# Altium project balan.PrjPcb
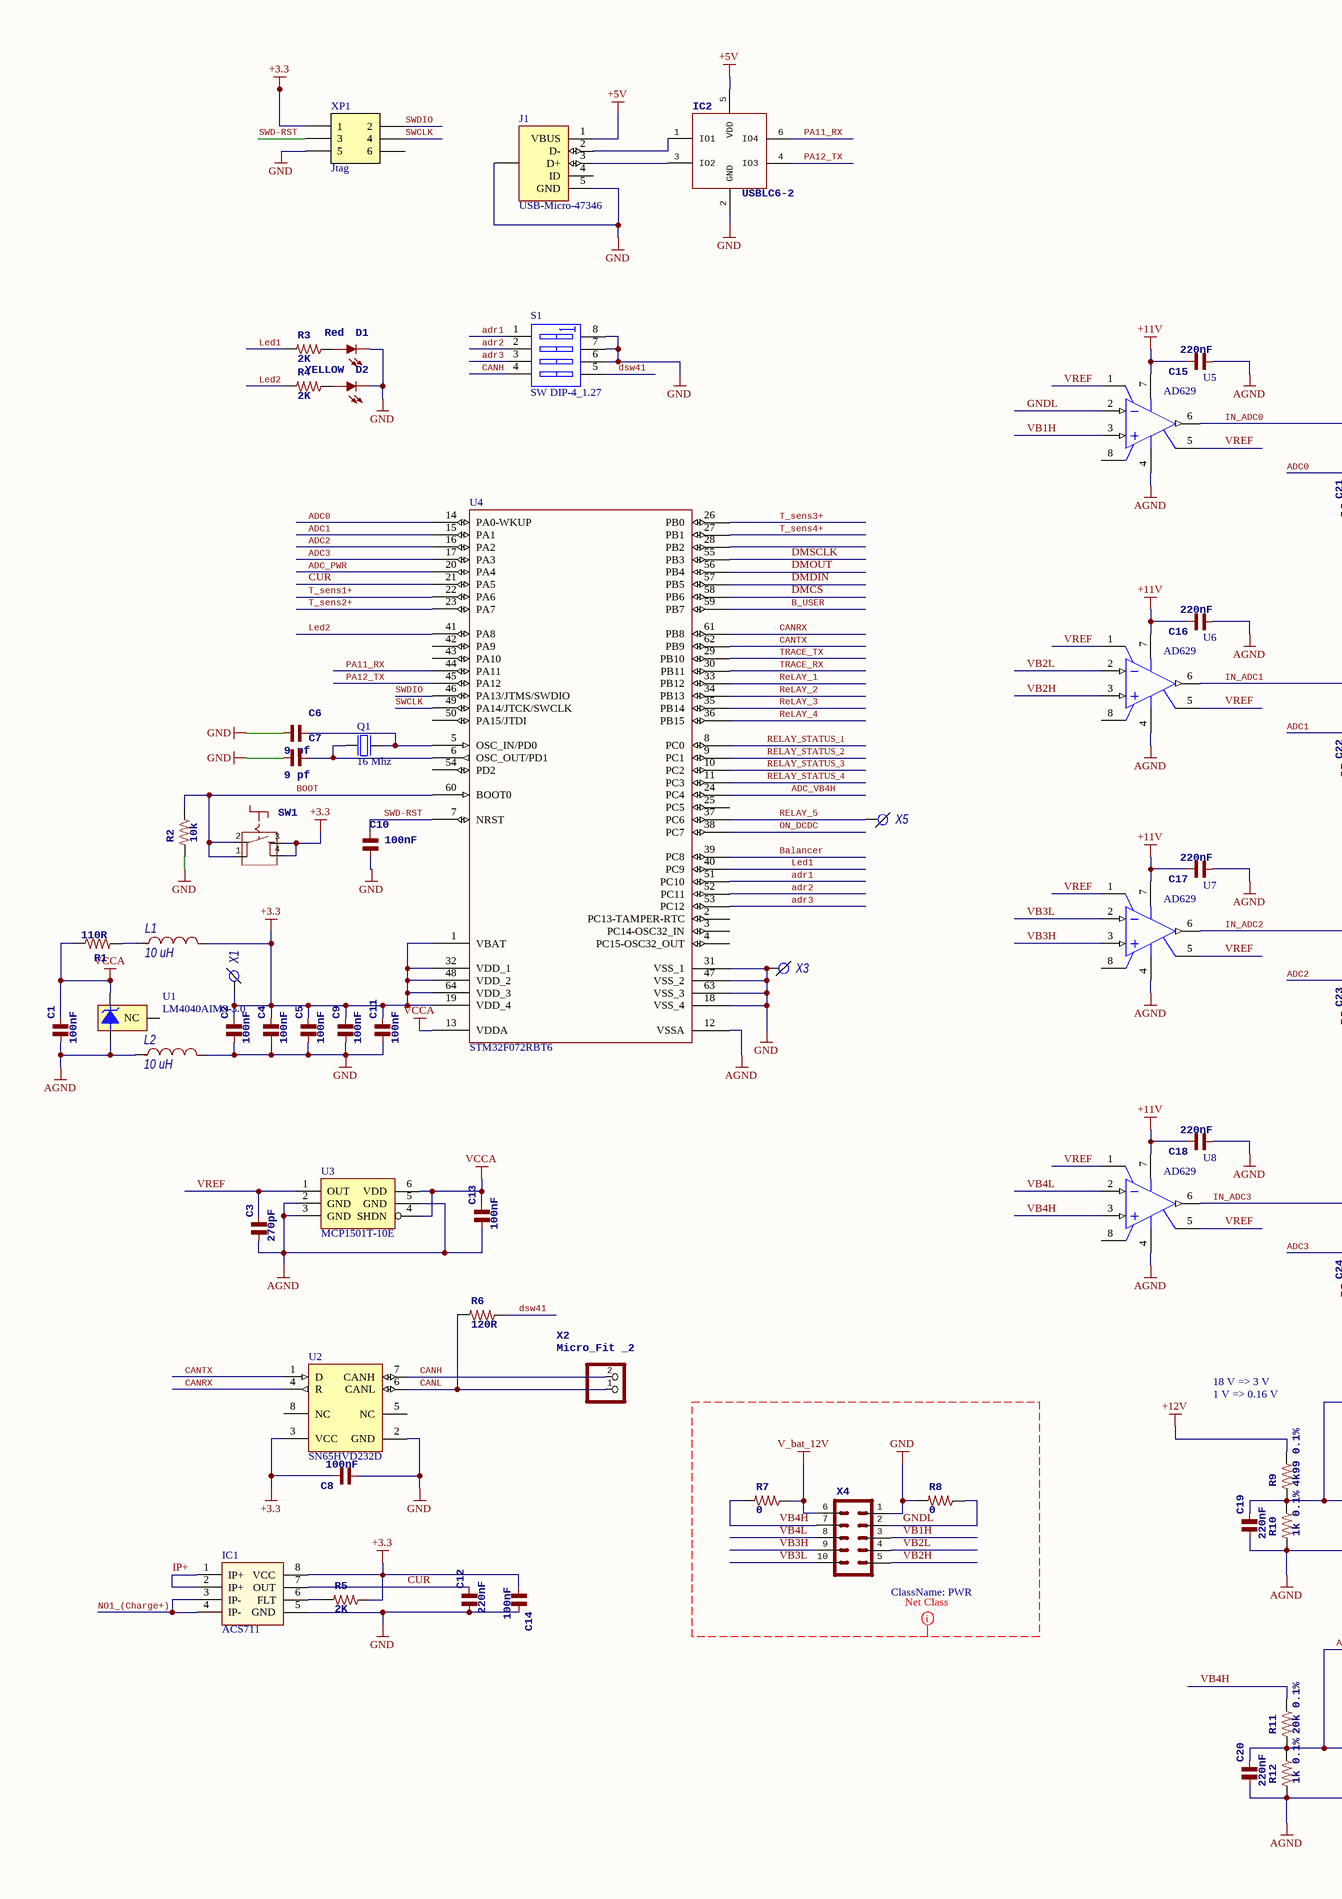
[diagram p0: Rev_C_Mcu.SchDoc, left]
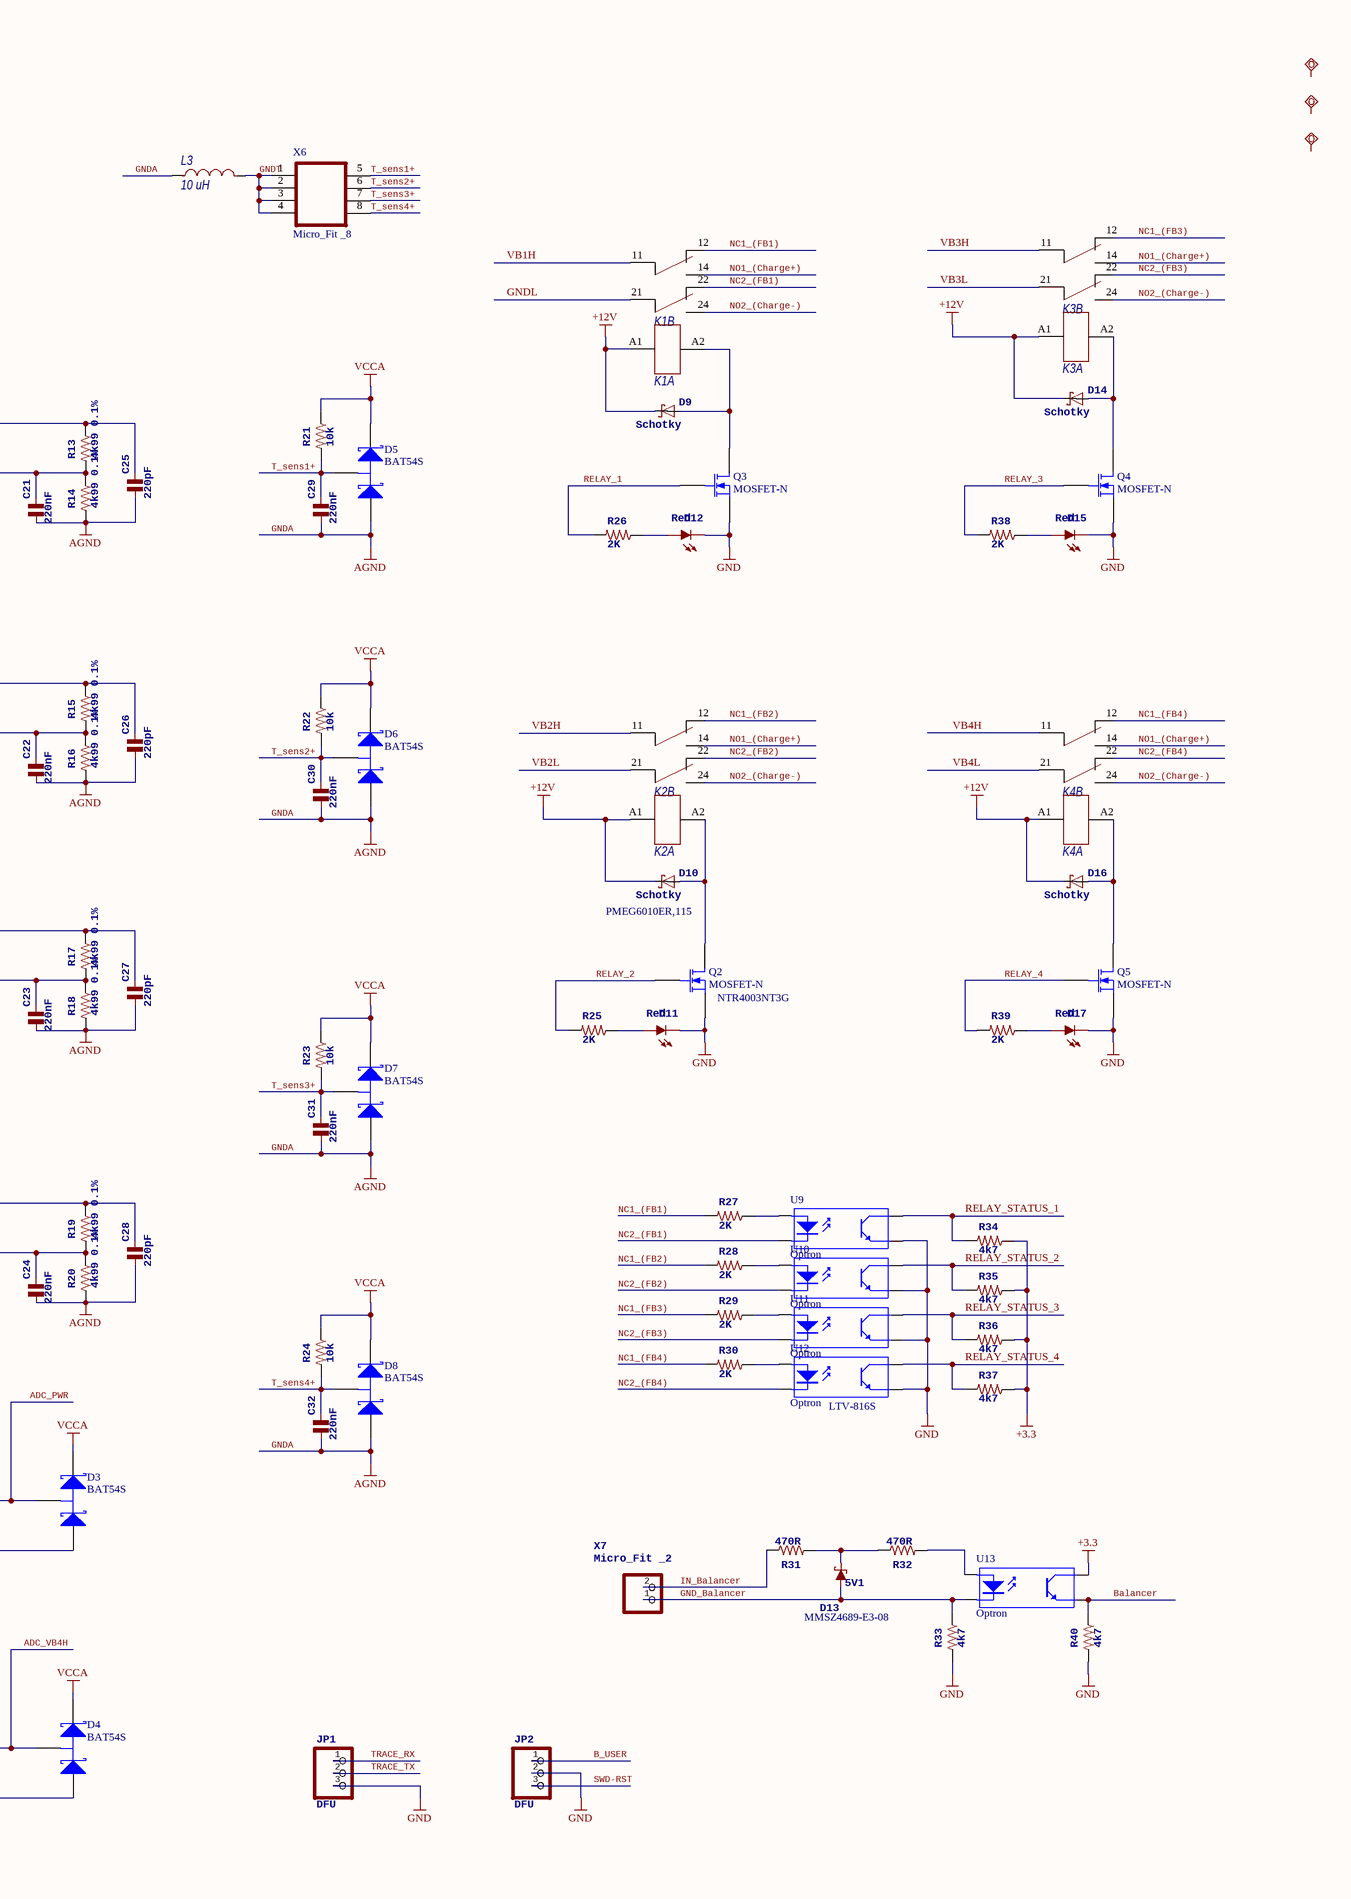
[diagram p1: Rev_C_Mcu.SchDoc, right]
2 sheets, 167 parts. Net scope: global (net labels, ports and power ports of the same name join across sheets).
Board file: balan_31.PcbDoc
Sheets:
  Rev_C_Mcu.SchDoc
  Rev_C_Power.SchDoc

## Sheet Rev_C_Mcu.SchDoc
size A2; Organization: Altium Limited; Address1: L3, 12a Rodborough Rd; Address2: Frenchs Forest; Address3: NSW; Address4: Australia 2086

### Parts
C1  100nF  [C0603]
C2  100nF  [C0603]
C3  270pF  [C0603]
C4  100nF  [C0603]
C5  100nF  [C0603]
C6  9 pf  [C0603]
C7  9 pf  [C0603]
C8  100nF  [C0603]
C9  100nF  [C0603]
C10  100nF  [C0603]
C11  100nF  [C0603]
C12  220nF  [C0603]
C13  100nF  [C0603]
C14  100nF  [C0603]
C15  220nF  [C0603]
C16  220nF  [C0603]
C17  220nF  [C0603]
C18  220nF  [C0603]
C19  220nF  [C0603]
C20  220nF  [C0603]
C21  220nF  [C0603]
C22  220nF  [C0603]
C23  220nF  [C0603]
C24  220nF  [C0603]
C25  220pF  [C0603]
C26  220pF  [C0603]
C27  220pF  [C0603]
C28  220pF  [C0603]
C29  220nF  [C0603]
C30  220nF  [C0603]
C31  220nF  [C0603]
C32  220nF  [C0603]
D1  Red  [CHIP-LED0603]
D2  YELLOW  [CHIP-LED0603]
D3  BAT54S  [SOT23_N]
D4  BAT54S  [SOT23_N]
D5  BAT54S  [SOT23_N]
D6  BAT54S  [SOT23_N]
D7  BAT54S  [SOT23_N]
D8  BAT54S  [SOT23_N]
D9  Schotky  [SOD123F]
D10  Schotky  Des: PMEG6010ER,115  [SOD123F]
D11  Red  [CHIP-LED0603]
D12  Red  [CHIP-LED0603]
D13  5V1  [425]
D14  Schotky  [SOD123F]
D15  Red  [CHIP-LED0603]
D16  Schotky  [SOD123F]
D17  Red  [CHIP-LED0603]
IC1  ACS711  [SO8-ACS]
IC2  USBLC6-2  [SOT23-6L]
J1  USB-Micro-47346  [USB_micro_B]
JP1  DFU  [1X03]
JP2  DFU  [1X03]
K1  Rele_RTE24012  [Switch_RTE24024]  (value not drawn)  (parts A,B of 2)
K2  Rele_RTE24012  [Switch_RTE24024]  (value not drawn)  (parts A,B of 2)
K3  Rele_RTE24012  [Switch_RTE24024]  (value not drawn)  (parts A,B of 2)
K4  Rele_RTE24012  [Switch_RTE24024]  (value not drawn)  (parts A,B of 2)
L1  10 uH  [C0603]
L2  10 uH  [C0603]
L3  10 uH  [C0603]
Q1  16 Mhz  [KX-7]
Q2  MOSFET-N  [SOT23-3N]
Q3  MOSFET-N  [SOT23-3N]
Q4  MOSFET-N  [SOT23-3N]
Q5  MOSFET-N  [SOT23-3N]
R1  110R  [R0603]
R2  10k  [R0603]
R3  2K  [R0603]
R4  2K  [R0603]
R5  2K  [R0603]
R6  120R  [R0603]
R7  0  [R1206]
R8  0  [R1206]
R9  4k99 0.1%  [R0603]
R10  1k 0.1%  [R0603]
R11  20k 0.1%  [R0603]
R12  1k 0.1%  [R0603]
R13  4k99 0.1%  [R0603]
R14  4k99 0.1%  [R0603]
R15  4k99 0.1%  [R0603]
R16  4k99 0.1%  [R0603]
R17  4k99 0.1%  [R0603]
R18  4k99 0.1%  [R0603]
R19  4k99 0.1%  [R0603]
R20  4k99 0.1%  [R0603]
R21  10k  [R0603]
R22  10k  [R0603]
R23  10k  [R0603]
R24  10k  [R0603]
R25  2K  [R0603]
R26  2K  [R0603]
R27  2K  [R0603]
R28  2K  [R0603]
R29  2K  [R0603]
R30  2K  [R0603]
R31  470R  [R0603]
R32  470R  [R0603]
R33  4k7  [R0603]
R34  4k7  [R0603]
R35  4k7  [R0603]
R36  4k7  [R0603]
R37  4k7  [R0603]
R38  2K  [R0603]
R39  2K  [R0603]
R40  4k7  [R0603]
S1  SW DIP-4_1.27  [218-4LPSTR]
SW1  PTS840 GKP SMTR LFS  [PTS840-P]  (value not drawn)
T1  TPP-SMD-15R  [SMD-15R]  (value not drawn)
T2  TPP-SMD-15R  [SMD-15R]  (value not drawn)
T3  TPP-SMD-15R  [SMD-15R]  (value not drawn)
U1  LM4040AIM3-3.0  [MF03A_N]
U2  SN65HVD232D  [D8_L]
U3  MCP1501T-10E  [SOT23-6L]
U4  STM32F072RBT6  [LQFP64_N]
U5  AD629  [ADI-R-8_N]
U6  AD629  [ADI-R-8_N]
U7  AD629  [ADI-R-8_N]
U8  AD629  [ADI-R-8_N]
U9  Optron  [LTV-816S]
U10  Optron  [LTV-816S]
U11  Optron  [LTV-816S]
U12  Optron  [LTV-816S]
U13  Optron  [LTV-816S]
X1  VDD  [Pin Header 1x1 TH Pitch 2.54mm]  (value not drawn)
X2  Micro_Fit _2  [43045-020X]
X3  GND  [Pin Header 1x1 TH Pitch 2.54mm]  (value not drawn)
X4  Mini-Fit 0039301101  [Mini-Fit 0039301101]  (value not drawn)
X5  RL5  [Pin Header 1x1 TH Pitch 2.54mm]  (value not drawn)
X6  Micro_Fit _8  [Micro_Fit_8]
X7  Micro_Fit _2  [43045-020X]
XP1  Jtag  [TC2030-IDC]  (no BOM)

### Nets
+3.3: C2.2 C4.2 C5.2 C8.2 C9.2 C11.2 C14.1 IC1.8(VCC) L1.2 R5.2 R34.2 R35.2 R36.2 R37.2 SW1.3(S) SW1.4(S) U2.3(VCC) U4.1(VBAT) U4.19(VDD_4) U4.32(VDD_1) U4.48(VDD_2) U4.64(VDD_3) U13.4(C) X1.1 XP1.1
+5V: IC2.5(VDD) J1.1(VBUS)
+11V: C15.2 C16.2 C17.2 C18.2 U5.7(+VS) U6.7(+VS) U7.7(+VS) U8.7(+VS)
+12V: D9.C D10.C D14.C D16.C K1.A1 K2.A1 K3.A1 K4.A1 R9.2
GND: C2.1 C4.1 C5.1 C6.2 C7.2 C8.1 C9.1 C10.1 C11.1 C12.1 C14.2 D1.C D2.C D11.C D12.C D15.C D17.C IC1.5(GND) IC2.2(GND) J1.5(GND) J1.SHIELD(SHLD) JP1.3 JP2.2 L2.2 Q1.2(GND) Q1.4(GND) Q2.2(S) Q3.2(S) Q4.2(S) Q5.2(S) R2.1 R8.1 R33.1 R40.1 S1.6(B3) S1.7(B2) S1.8(B1) U2.2(GND) U4.18(VSS_4) U4.31(VSS_1) U4.47(VSS_2) U4.63(VSS_3) U9.3(E) U10.3(E) U11.3(E) U12.3(E) X3.1 X4.1 XP1.5
GNDA: C1.1 C3.1 C13.1 C15.1 C16.1 C17.1 C18.1 C19.1 C20.1 C21.1 C22.1 C23.1 C24.1 C25.1 C26.1 C27.1 C28.1 C29.1 C30.1 C31.1 C32.1 D3.1(A) D4.1(A) D5.1(A) D6.1(A) D7.1(A) D8.1(A) L2.1 L3.1 R10.1 R12.1 R14.1 R16.1 R18.1 R20.1 U1.2(-V) U3.2(GND) U3.3(GND) U3.5(GND) U4.12(VSSA) U5.4(-VS) U6.4(-VS) U7.4(-VS) U8.4(-VS)  [also labelled AGND]
IP+: IC1.1(IP+) IC1.2(IP+)
NO2_(Charge-): K1.24 K2.24 K3.24 K4.24
V_bat_12V: R7.2 X4.6
VCCA: C1.2 C13.2 D3.2(K) D4.2(K) D5.2(K) D6.2(K) D7.2(K) D8.2(K) R1.2 R21.2 R22.2 R23.2 R24.2 U1.1(+V) U3.4(SHDN) U3.6(VDD) U4.13(VDDA)
ADC0: C21.2 R13.1 R14.2 U4.14(PA0-WKUP)
ADC1: C22.2 R15.1 R16.2 U4.15(PA1)
ADC2: C23.2 R17.1 R18.2 U4.16(PA2)
ADC3: C24.2 R19.1 R20.2 U4.17(PA3)
ADC_PWR: C19.2 D3.3(C) R9.1 R10.2 U4.20(PA4)
ADC_VB4H: C20.2 D4.3(C) R11.1 R12.2 U4.24(PC4)
adr1: S1.1(A1) U4.51(PC10)
adr2: S1.2(A2) U4.52(PC11)
adr3: S1.3(A3) U4.53(PC12)
B_USER: JP2.1 U4.59(PB7)
Balancer: R40.2 U4.39(PC8) U13.3(E)
BOOT: R2.2 SW1.1(P) SW1.2(P) U4.60(BOOT0)
CANH: S1.4(A4) U2.7(CANH) X2.2(+12V)
CANL: R6.1 U2.6(CANL) X2.1(GND)
CANRX: U2.4(R) U4.61(PB8)
CANTX: U2.1(D) U4.62(PB9)
CUR: C12.2 IC1.7(OUT) U4.21(PA5)
DMCS: U4.58(PB6)
DMDIN: U4.57(PB5)
DMOUT: U4.56(PB4)
DMSCLK: U4.55(PB3)
dsw41: R6.2 S1.5(B4)
GND_Balancer: D13.2 R33.2 U13.2(K) X7.1(GND)
GNDL: K1.21 R8.2 U5.2(-IN) X4.2
GNDT: L3.2 X6.1(S) X6.2(S) X6.3(S) X6.4(S)
IN_ADC0: C25.2 R13.2 U5.6(OUTPUT)
IN_ADC1: C26.2 R15.2 U6.6(OUTPUT)
IN_ADC2: C27.2 R17.2 U7.6(OUTPUT)
IN_ADC3: C28.2 R19.2 U8.6(OUTPUT)
IN_Balancer: R31.2 X7.2(+12V)
Led1: R3.1 U4.40(PC9)
Led2: R4.1 U4.41(PA8)
NC1_(FB1): K1.12 R27.1
NC1_(FB2): K2.12 R28.1
NC1_(FB3): K3.12 R29.1
NC1_(FB4): K4.12 R30.1
NC2_(FB1): K1.22 U9.2(K)
NC2_(FB2): K2.22 U10.2(K)
NC2_(FB3): K3.22 U11.2(K)
NC2_(FB4): K4.22 U12.2(K)
NO1_(Charge+): IC1.3(IP-) IC1.4(IP-) K1.14 K2.14 K3.14 K4.14
ON_DCDC: U4.38(PC7)
PA11_RX: IC2.6(IO4) U4.44(PA11)
PA12_TX: IC2.4(IO3) U4.45(PA12)
ReLAY_1: Q3.1(G) R26.1 U4.33(PB12)
ReLAY_2: Q2.1(G) R25.1 U4.34(PB13)
ReLAY_3: Q4.1(G) R38.1 U4.35(PB14)
ReLAY_4: Q5.1(G) R39.1 U4.36(PB15)
RELAY_5: U4.37(PC6) X5.1
RELAY_STATUS_1: R34.1 U4.8(PC0) U9.4(C)
RELAY_STATUS_2: R35.1 U4.9(PC1) U10.4(C)
RELAY_STATUS_3: R36.1 U4.10(PC2) U11.4(C)
RELAY_STATUS_4: R37.1 U4.11(PC3) U12.4(C)
SWCLK: U4.49(PA14/JTCK/SWCLK) XP1.4
SWD-RST: C10.2 JP2.3 U4.7(NRST) XP1.3
SWDIO: U4.46(PA13/JTMS/SWDIO) XP1.2
T_sens1+: C29.2 D5.3(C) R21.1 U4.22(PA6) X6.5(GND)
T_sens2+: C30.2 D6.3(C) R22.1 U4.23(PA7) X6.6(GND)
T_sens3+: C31.2 D7.3(C) R23.1 U4.26(PB0) X6.7(GND)
T_sens4+: C32.2 D8.3(C) R24.1 U4.27(PB1) X6.8(GND)
TRACE_RX: JP1.1 U4.30(PB11)
TRACE_TX: JP1.2 U4.29(PB10)
VB1H: K1.11 U5.3(+IN) X4.3
VB2H: K2.11 U6.3(+IN) X4.5
VB2L: K2.21 U6.2(-IN) X4.4
VB3H: K3.11 U7.3(+IN) X4.9
VB3L: K3.21 U7.2(-IN) X4.10
VB4H: K4.11 R7.1 R11.2 U8.3(+IN) X4.7
VB4L: K4.21 U8.2(-IN) X4.8
VREF: C3.2 U3.1(OUT) U5.1(-RG) U5.5(REF) U6.1(-RG) U6.5(REF) U7.1(-RG) U7.5(REF) U8.1(-RG) U8.5(REF)
NetC6_1: C6.1 Q1.3(out) U4.5(OSC_IN/PD0)
NetC7_1: C7.1 Q1.1(inp) U4.6(OSC_OUT/PD1)
NetD1_A: D1.A R3.2
NetD2_A: D2.A R4.2
NetD9_A: D9.A K1.A2 Q3.3(D)
NetD10_A: D10.A K2.A2 Q2.3(D)
NetD11_A: D11.A R25.2
NetD12_A: D12.A R26.2
NetD13_1: D13.1 R31.1 R32.2
NetD14_A: D14.A K3.A2 Q4.3(D)
NetD15_A: D15.A R38.2
NetD16_A: D16.A K4.A2 Q5.3(D)
NetD17_A: D17.A R39.2
NetIC1_6: IC1.6(FLT) R5.1
NetIC2_1: IC2.1(IO1) J1.2(D-)
NetIC2_3: IC2.3(IO2) J1.3(D+)
NetL1_1: L1.1 R1.1
NetR27_2: R27.2 U9.1(A)
NetR28_2: R28.2 U10.1(A)
NetR29_2: R29.2 U11.1(A)
NetR30_2: R30.2 U12.1(A)
NetR32_1: R32.1 U13.1(A)

Not connected (* = marked no-connect by the designer): J1 4(ID); T1 TP; T2 TP; T3 TP; U1 3(NC); U2 5(NC) 8(NC); U4 2(PC13-TAMPER-RTC) 3(PC14-OSC32_IN) 4(PC15-OSC32_OUT) 25(PC5) 28(PB2) 42(PA9) 43(PA10) 50(PA15/JTDI) 54(PD2); U5 8(+RG); U6 8(+RG); U7 8(+RG); U8 8(+RG); XP1 6

### Layout directives
net class PWR: GND, GNDL, V_bat_12V, VB1H, VB2H, VB2L, VB3H, VB3L, VB4H, VB4L

### Notes on the sheet
- 18 V => 3 V
- 1 V => 0.16 V
- Title
- Size:
- Date:
- File:
- A2
- Number:
- Time:
- Revision:
- Sheet
- of

### Library data of the parts
C1 C2 C4 C5 C8-C11 C13 C14 = C_0603: GRM188R71E104KA01J; MPN: GRM188F51E104ZA01D; MF: MURATA; OC_FARNELL: 1828902; Value: 100nF
C3 = C_0603: CC0603KRX7R9BB271; MF: Yageo; MPN: CC0603KRX7R9BB271; Value: 270pF
C6 C7 = C_0603: GRM1885C1H9R0DA01D; MF: MURATA; Value: 9 pf
C12 C15-C24 C29-C32 = C_0603: TMK107B7224KA-T; MF: MURATA; Value: 220nF
C25-C28 = C_0603: CC0603KRX7R9BB221; MF: Yageo; MPN: CC0603KRX7R9BB221; Value: 220pF
D1 D11 D12 D15 D17 = LEDCHIP-LED0603_2: 150060RS75000; BLUE: 150060BS75000; GREEN: 150060VS75000; YELLOW: 150060YS75000; Manufacturer Part Number: 150060RS75000; RED: 150060RS75000; Value: Red
D2 = LEDCHIP-LED0603_2: 150060YS75000; Manufacturer Part Number: 150060RS75000; BLUE: 150060BS75000; GREEN: 150060VS75000; RED: 150060RS75000; Value: YELLOW; YELLOW: 150060YS75000
D3-D8 = BAT54S_1: TBAT54S,LM; Published: 17-Sep-2003; LatestRevisionDate: 12-Dec-2006; LatestRevisionNote: IPC-7351 Footprint Added.; DatasheetVersion: 4-Mar-2002; PackageVersion: May-1999; PackageReference: SOT23; Publisher: Altium Limited; PackageDescription: 3-Pin SOT-23 Package 0.95 mm Pitch, 2.3 mm Lead Span; ComponentLink1Description: Manufacturer Link; ComponentLink1URL: http://www.semiconductors.philips.com/; ComponentLink2Description: Datasheet; ComponentLink2URL: http://www.semiconductors.philips.com/acrobat/datasheets/BAT54_SERIES_4.pdf
D9 D10 D14 D16 = SCHOTTKYSOD-123: PMEG4010ETR,115; PN: PMEG6010ER
D13 = SCHOTTKY-1: MMSZ4689-E3-08; Value: 5V1; Des: MMSZ4689-E3-08
IC1 = ACS711: ACS711ELCTR-12AB-T; Current: 12,5; Value: ACS711; Manufacturer Part Number: ACS711ELCTR-12AB-T
IC2 = USBLC6-2: USBLC6-2SC6; OC_FARNELL: unknown
J1 = USB-Micro-47346: 47346-0001; ComponentLink1Description: Manufacturer Link; ComponentLink1URL: http://www.tycoelectronics.com/
JP1 JP2 = PINHD-1X3: DNP; OC_FARNELL: unknown
K1-K4 = Rele_RTE24012: RTE24012
L1-L3 = L2: KLZ1608MHR100WTD25; group: Индуктивность; value: 10 uH; sheet: ="value"+' '+"tollerance"+' '+"package"; list: ="value"+' '+"tollerance"+' '+"package"+' '+"document"
Q1 = XTAL_4-pin_grounded: TSX-3225 16.0000MF18X-AC3
Q2-Q5 = MOSFET-N: NTR4003NT3G; Published: 8-Jun-2000; LatestRevisionDate: 17-Jul-2002; LatestRevisionNote: Re-released for DXP Platform.; PackageVersion: 1995/1996; PackageReference: E3; Publisher: Altium Limited; PackageDescription: TO, Flat Index; 3 In-Line, Axial Leads; Body Dia. 4.6mm; Lead Dia. 0.5 mm (max)
  Q2: Des: NTR4003NT3G
R1 = R_0603_18: RC0603FR-07110RL; OC_FARNELL: unknown; Manufacturer Part Number: RC0603FR-07110RL; Value: 110R
R2 R21-R24 = R_0603_18: RC0603FR-0710KL; OC_FARNELL: unknown; Manufacturer Part Number: RC0603FR-0710KL; Value: 10k
R3-R5 R25-R30 R38 R39 = R_0603_18: RC0603FR-072KL; OC_FARNELL: unknown; Manufacturer Part Number: RC0603FR-072KL; Value: 2K
R6 = R_0603_18: RC0603FR-07120RL; OC_FARNELL: unknown; Manufacturer Part Number: RC0603FR-07120RL; Value: 120R
R7 R8 = R_0603_18: DNP; Manufacturer Part Number: RC0603FR-0710KL; OC_FARNELL: unknown; Value: 0
R9 R13-R20 = R_0603_18: ERA-3AEB4991V; OC_FARNELL: unknown; Manufacturer Part Number: ERA-3AEB4991V; Value: 4k99 0.1%
R10 R12 = R_0603_18: ERA-3AEB102V; OC_FARNELL: unknown; Manufacturer Part Number: ERA-3AEB102V; Value: 1k 0.1%
R11 = R_0603_18: ERA-3AEB203V; OC_FARNELL: unknown; Manufacturer Part Number: ERA-3AEB203V; Value: 20k 0.1%
R31 R32 = R_0603_18: RC0603FR-07470RL; OC_FARNELL: unknown; Manufacturer Part Number: RC0603FR-07470RL; Value: 470R
R33-R37 R40 = R_0603_18: RC0603FR-074K7L; OC_FARNELL: unknown; Manufacturer Part Number: RC0603FR-074K7L; Value: 4k7
S1 = SW DIP-4_1.27: 218-4LPSTR; Published: 24-Mar-1999; LatestRevisionDate: 29-May-2009; LatestRevisionNote: IPC-7351 Footprint Added.; PackageVersion: Dec-2002; PackageReference: SO8; Publisher: Altium Limited; PackageDescription: 8-Pin Small Outline Integrated Circuit 1.27 mm Pitch; Code_JEDEC: MS-012-AA; Code_IPC: SOIC127P600-8
SW1 = PB_NOPTS840: Supplier 1: Digi-Key; Supplier Part Number 1: CKN10514CT-ND; Supplier 2: Mouser; Supplier Part Number 2: 611-PTS840GKPSMTR
T1-T3 = TPP-SMD-15R: DNP; BOM: EXCLUDE
U1 = LM4040AIM3-3.0: Manufacturer: National Semiconductor; PackageTopMarking: RKA*XTT; PowerWise: N; CompType: Voltage Reference IC; Published: 4-Dec-2008; DatasheetVersion: Apr-2005; PackageVersion: revB, Mar-2003; PackageReference: MF03A; Publisher: Altium Limited; PackageDescription: Molded SOT-23, .115 x .051 x .037in Body, 3 Lead, .075 in Pitch; PartNumber: LM4040AIM3-3.0; RoHS: N; PinCount: 3; ComponentLink1Description: LM4040 Datasheet; ComponentLink1URL: http://www.national.com/ds/LM/LM4040.pdf; ComponentLink2Description: LM4040 Web Page; ComponentLink2URL: http://www.national.com/pf/LM/LM4040.html; ComponentLink3Description: MF03A Package Page; ComponentLink3URL: http://www.national.com/packaging/folders/mf03a.html
U2 = SN65HVD232D: Manufacturer: Texas Instruments; PartNumber: SN65HVD230D; Eco-Plan: Green (RoHS & no Sb/Br); SubFamily: CAN; Drivers Per Package: 1; Isolated: No; Transient Pulse Protection(V): -25 to 25; Low Power Mode: Standby; ICC(Max)(mA): 17; Supply Voltage(s)(V): 3.3; Rating: Catalog; DatasheetVersion: SLOS346K; PackageVersion: revM, Jun-2011; PackageReference: D8; PackageDescription: 8-Pin Plastic Small Outline Integrated Circuit, 4.9 x 3.9 mm, Pitch 1.27 mm Pitch; Supplier 1: Digi-Key; Supplier Part Number 1: SN65HVD230D-ND; Supplier 2: Farnell; Supplier Part Number 2: 1103105; Supplier 3: Newark; Supplier Part Number 3: 75C7744; Supplier 4: Mouser; Supplier Part Number 4: 595-SN65HVD230D; Receivers Per Package: 1; Footprint: PCA82C250; Mounting Technology: Surface Mount; Code_JEDEC: MS-012AA; ComponentLink1Description: Datasheet; ComponentLink1URL: http://www.ti.com/general/docs/lit/getliterature.tsp?genericPartNumber=SN65HVD230&fileType=pdf
U3 = MCP1501T-10E: MCP1501T-10E/CHY; Code_IPC: SOT23-6
U5-U8 = AD629: AD629ARZ; Generic Part Number: AD629ARZ; PartNumber: AD629ARZ
U9-U13 = Optoisolator1: LTV-816S; Published: 24-Mar-1999; LatestRevisionDate: 04-Mar-2005; LatestRevisionNote: Sch pins 3 & 4 Swapped.; DatasheetVersion: Nov-2003; PackageReference: DIP-4; Publisher: Altium Limited
  U12: Des: LTV-816S
X1 X3 X5 = Test Point: DNP
  X1: value: VDD; sheet: VDD; list: VDD
  X3: value: GND; sheet: GND; list: GND
  X5: value: RL5; sheet: RL5; list: RL5
X2 X7 = 2PIN43045-020X: 0430450200; Manufacturer Part Number: 0430450200
X4 = Mini-Fit 0039301101: 0039301101
X6 = Micro_Fit_8: 0430450800; Manufacturer Part Number: 0430450800
XP1 = TC2030-CTX-NL: Manufacturer: Tag-Connect LLC; Artikkelnr Noca: N.A.; Part Number: TC2030-CTX-NL; Manufacturer Part Number: TC2030-CTX-NL; Datasheet: http://www.tag-connect.com/Materials/TC2030-IDC-NL.pdf; Footprint: TC2030-IDC-NLFP; LatestRevisionDate: 2013-08-08; Pin Count: 6; Publisher: Nordic Semiconductor; Published: 2013-08-08; Value: TC2030-CTX-NL; Supplier: Tag-Connect; Supplier part number: TC2030-CTX-NL; 2nd source Supplier: *; 2nd source part number: *
U4 = STM32F072RBT6: PackageReference: LQFP64; Publisher: Altium Limited; PackageDescription: 64-Pin Low-Profile Quad Flat Pack, 10 x 10 mm Body, 0.5 mm Pitch (LQFP64); ComponentLink1Description: Manufacturer Link; ComponentLink1URL: www.st.com/stm32

## Sheet Rev_C_Power.SchDoc
size A3
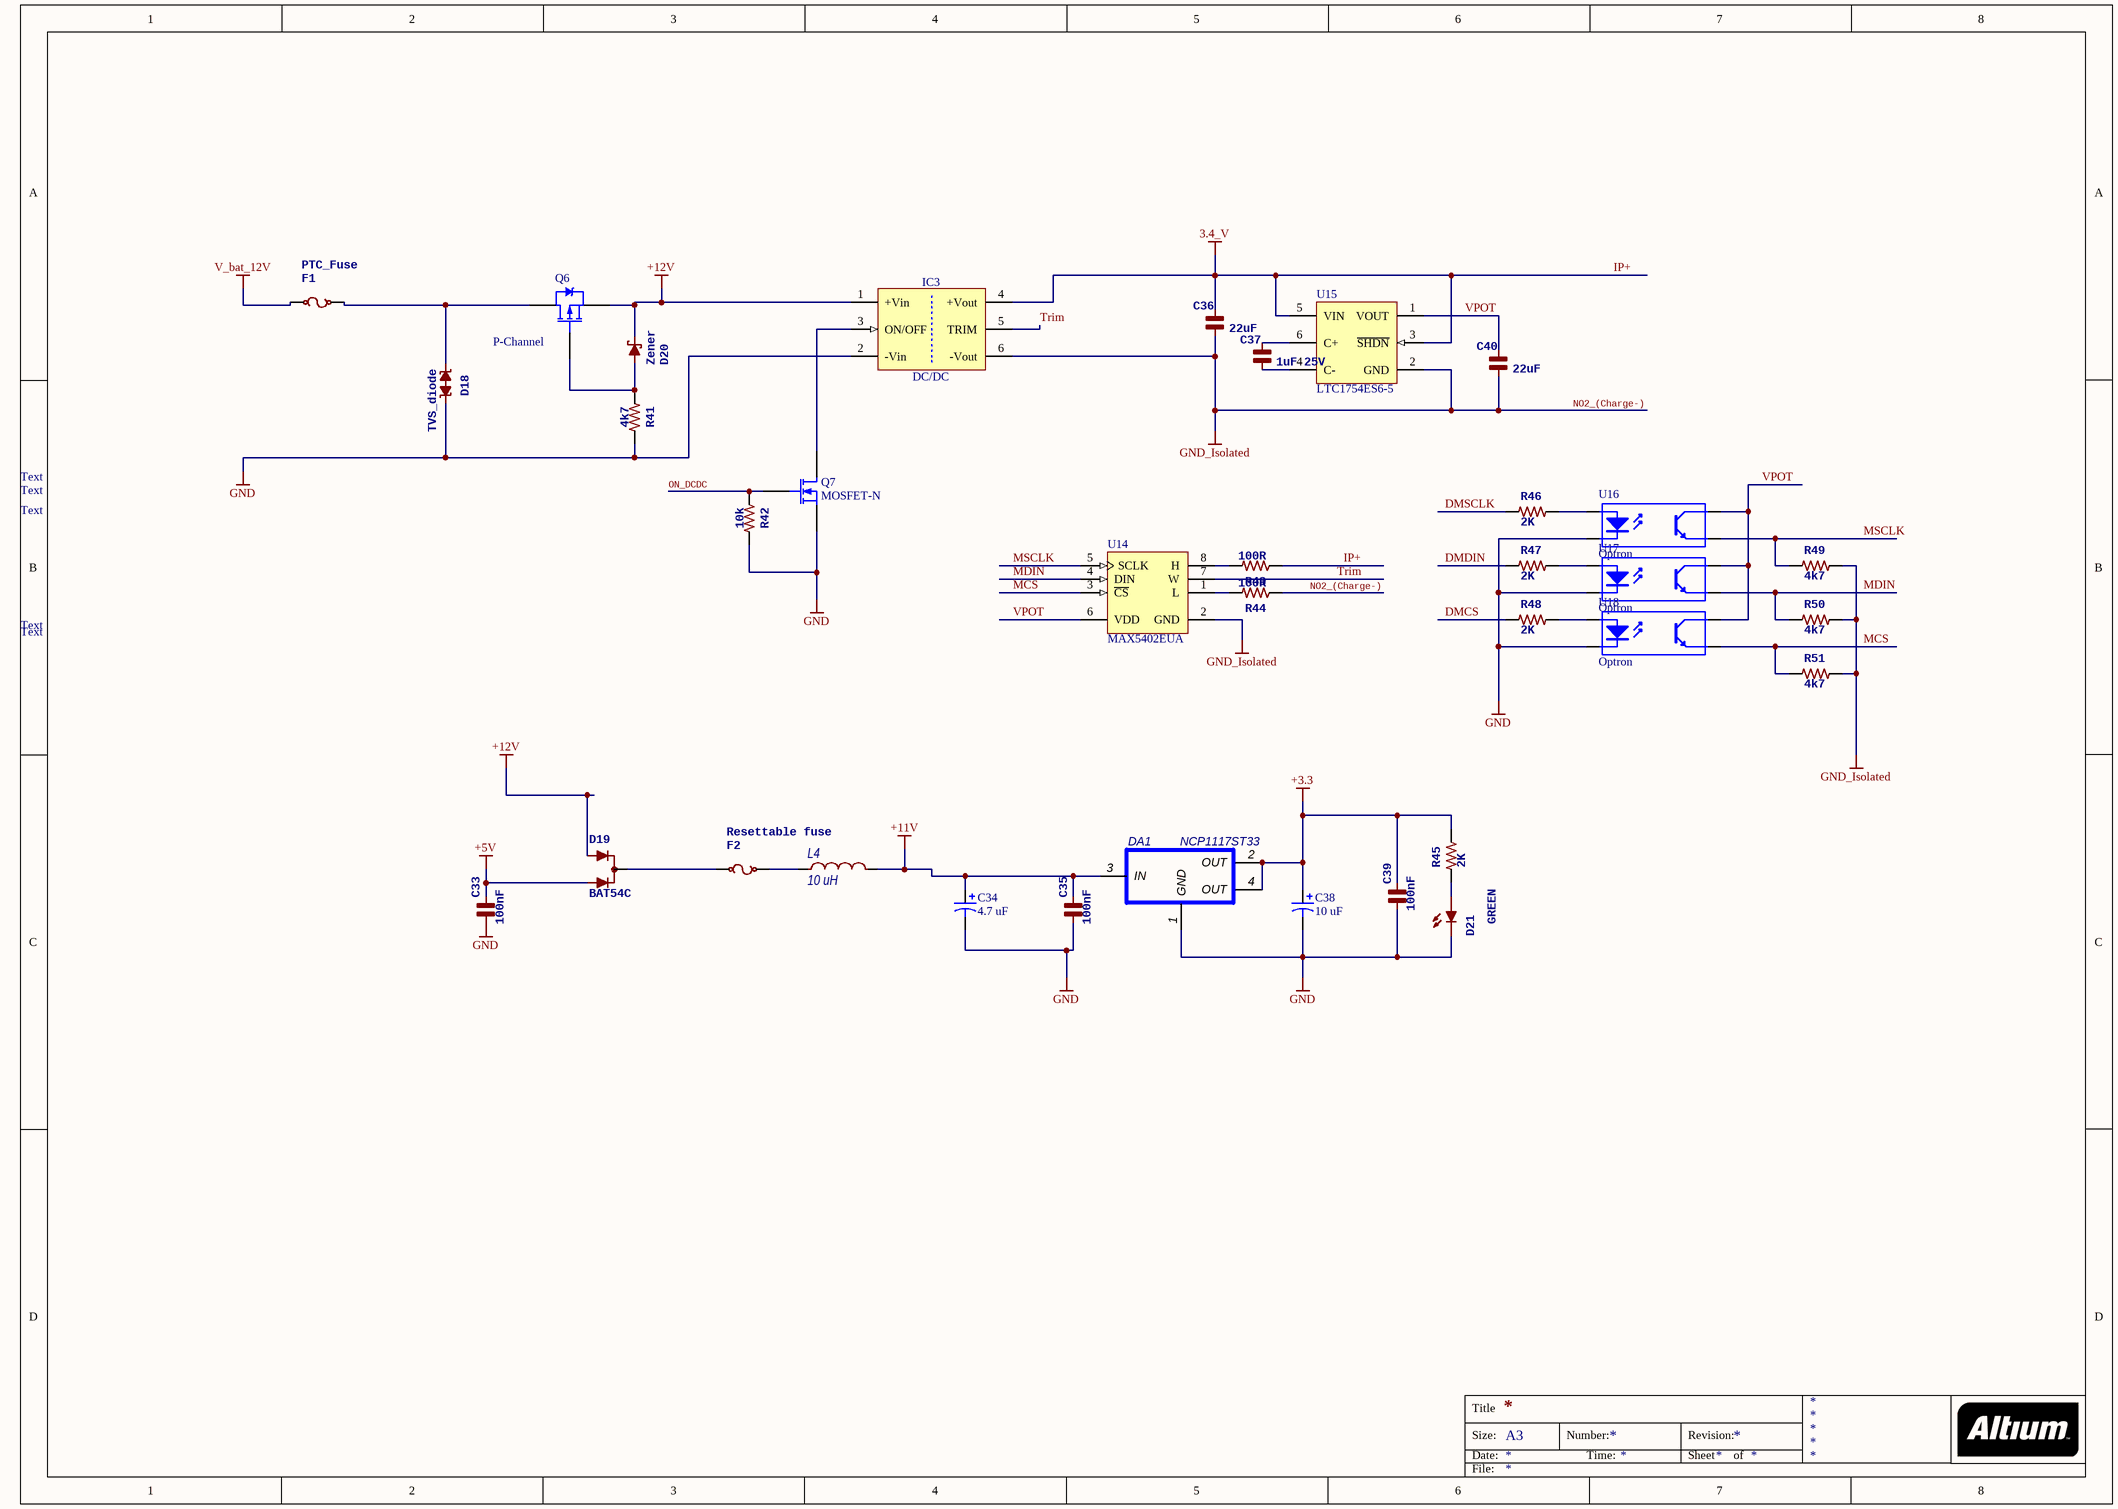
[diagram p2: Rev_C_Power.SchDoc]

### Parts
C33  100nF  [C0603]
C34  4.7 uF  [SMD D]
C35  100nF  [C0603]
C36  22uF  [C0603]
C37  1uF 25V  [C0603]
C38  10 uF  [SMD A]
C39  100nF  [C0603]
C40  22uF  [C0603]
D18  TVS_diode  [SMB_BIDIR]
D19  BAT54C  [SOT23]
D20  Zener  [SOD523]
D21  GREEN  [CHIP-LED0603]
DA1  NCP1117ST33  [SOT223]
F1  PTC_Fuse  [RUEF250]
F2  Resettable fuse  [R1206]
IC3  DC/DC  [DCDC_1x1]
L4  10 uH  [C0603]
Q6  P-Channel  [SO-8 - IRF FET]
Q7  MOSFET-N  [SOT23-3N]
R41  4k7  [R0603]
R42  10k  [R0603]
R43  100R  [R0603]
R44  100R  [R0603]
R45  2K  [R0603]
R46  2K  [R0603]
R47  2K  [R0603]
R48  2K  [R0603]
R49  4k7  [R0603]
R50  4k7  [R0603]
R51  4k7  [R0603]
U14  MAX5402EUA  [MAXM-U8-1_N]
U15  LTC1754ES6-5  [LT-S6-6-SOT-23_N]
U16  Optron  [LTV-816S]
U17  Optron  [LTV-816S]
U18  Optron  [LTV-816S]

### Nets
+3.3: C38.1 C39.2 DA1.2(OUT) DA1.4(OUT) R45.2
+5V: C33.2 D19.2(A2)
+11V: C34.1 C35.2 DA1.3(IN) L4.2
+12V: D19.1(A1) D20.C IC3.1(+Vin) Q6.1(S)
GND: C33.1 C34.2 C35.1 C38.2 C39.1 D18.2 D21.C DA1.1(GND) IC3.2(-Vin) Q7.2(S) R41.2 R42.2 U16.2(K) U17.2(K) U18.2(K)
IP+: C36.2 IC3.4(+Vout) R43.1 U15.3(~{SHDN}) U15.5(VIN)  [also labelled 3.4_V]
NO2_(Charge-): C36.1 C40.1 IC3.6(-Vout) R44.1 R49.2 R50.2 R51.2 U14.2(GND) U15.2(GND)  [also labelled GND_Isolated]
V_bat_12V: F1.1
DMCS: R48.1
DMDIN: R47.1
DMSCLK: R46.1
MCS: R51.1 U14.3(~{CS}) U18.3(E)
MDIN: R50.1 U14.4(DIN) U17.3(E)
MSCLK: R49.1 U14.5(SCLK) U16.3(E)
ON_DCDC: Q7.1(G) R42.1
Trim: IC3.5(TRIM) U14.7(W)
VPOT: C40.2 U14.6(VDD) U15.1(VOUT) U16.4(C) U17.4(C) U18.4(C)
NetC37_1: C37.1 U15.4(C-)
NetC37_2: C37.2 U15.6(C+)
NetD18_1: D18.1 F1.2 Q6.3(D)
NetD19_3: D19.3(C) F2.1
NetD20_A: D20.A Q6.2(G) R41.1
NetD21_A: D21.A R45.1
NetF2_2: F2.2 L4.1
NetIC3_3: IC3.3(ON/OFF) Q7.3(D)
NetR43_2: R43.2 U14.8(H)
NetR44_2: R44.2 U14.1(L)
NetR46_2: R46.2 U16.1(A)
NetR47_2: R47.2 U17.1(A)
NetR48_2: R48.2 U18.1(A)

### Notes on the sheet
- Text
- Title
- Size:
- Date:
- A3
- Number:
- Time:
- Revision:
- Sheet
- of
- File:

### Library data of the parts
C33 C35 C39 = C_0603: as C1 on sheet Rev_C_Mcu; OC_FARNELL: 1828902; Value: 100nF
C34 = Cap Pol2: 293D475X9050D2WE3; Published: 8-Jun-2000; LatestRevisionDate: 17-Jul-2002; LatestRevisionNote: Re-released for DXP Platform.; PackageReference: POLAR0.8; Publisher: Altium Limited; PackageDescription: Polarized Capacitor; 2 Leads; Value: 4.7 uF
C36 C40 = C_0603: ZRB18AR61A226ME01L; MF: MURATA; Value: 22uF
C37 = C_0603: 885012106022; MF: MURATA; Value: 1uF 25V
C38 = Cap Pol2: THJA106K010AJN; Published: 8-Jun-2000; LatestRevisionDate: 17-Jul-2002; LatestRevisionNote: Re-released for DXP Platform.; PackageReference: POLAR0.8; Publisher: Altium Limited; PackageDescription: Polarized Capacitor; 2 Leads; Value: 10 uF
D18 = DIODE-TVS-SMAJ_1: SMAJ17CA
D19 = BAT54C: BAT54C-G; OC_FARNELL: unknown
D20 = SCHOTTKY-DIODESMA_2: BZT52C10T-7
D21 = LEDCHIP-LED0603_2: 150060VS75000; Manufacturer Part Number: 150060RS75000; BLUE: 150060BS75000; YELLOW: 150060YS75000; GREEN: 150060VS75000; RED: 150060RS75000; Value: GREEN
DA1 = NCP1117ST33: NCP1117LPST33T3G; Title: stabilizer; Value: *
F1 = RUEF250: Value: 9A
F2 = 3216CP-3A_1: 0ZCJ0050AF2E; Value: 500mA
IC3 = DCDC_TDK_30_Single Output: PDQ30-Q24-S3-D
L4 = L2: KLZ1608MHR100WTD25; group: Индуктивность; value: 10 uH; sheet: ="value"+' '+"tollerance"+' '+"package"; list: ="value"+' '+"tollerance"+' '+"package"+' '+"document"
Q6 = PMOS-2: FDS6681Z; Note: Pin 4 not drawn and electrically connected to Pin 2.; Published: 8-Jun-2000; LatestRevisionDate: 17-Jul-2002; LatestRevisionNote: Re-released for DXP Platform.; DatasheetVersion: PD-9.390D; PackageVersion: Feb-1997; PackageReference: TO-220AB; Publisher: Altium Limited; PackageDescription: TO, Thru-Hole, Vertical, Heatsink Mounted; 3 In-Line Leads; Pitch 2.54 mm; ComponentLink1Description: Manufacturer Link; ComponentLink1URL: http://www.irf.com/
Q7 = MOSFET-N: NTR4170NT1G; Published: 8-Jun-2000; LatestRevisionDate: 17-Jul-2002; LatestRevisionNote: Re-released for DXP Platform.; PackageVersion: 1995/1996; PackageReference: E3; Publisher: Altium Limited; PackageDescription: TO, Flat Index; 3 In-Line, Axial Leads; Body Dia. 4.6mm; Lead Dia. 0.5 mm (max)
R41 R49-R51 = R_0603_18: RC0603FR-074K7L; OC_FARNELL: unknown; Manufacturer Part Number: RC0603FR-074K7L; Value: 4k7
R42 = R_0603_18: RC0603FR-0710KL; OC_FARNELL: unknown; Manufacturer Part Number: RC0603FR-0710KL; Value: 10k
R43 R44 = R_0603_18: RC0603FR-07100RL; OC_FARNELL: unknown; Manufacturer Part Number: RC0603FR-07100RL; Value: 100R
R45-R48 = R_0603_18: RC0603FR-072KL; OC_FARNELL: unknown; Manufacturer Part Number: RC0603FR-072KL; Value: 2K
U14 = MAX5402EUA: MAX5402EUA+; Control Interface: 3-Wire Serial; DatasheetVersion: Rev. 0; PackageVersion: Rev. L, 08/2009; PackageReference: U8-1; PackageDescription: 8-Pin Micro-MAX, Thin Shrink Small-Outline (U8-1), Body 3 x 3 mm, Pitch 0.65mm; Supplier 1: Digi-Key; Supplier Part Number 1: MAX5402EUA-ND; Supplier 2: Mouser; Supplier Part Number 2: N/A; Mounting Technology: Surface Mount; Code_JEDEC: MO-187; PartNumber: MAX5402EUA; ComponentLink1Description: Manufacturer URL; ComponentLink1URL: http://www.maximintegrated.com/; ComponentLink2Description: Datasheet; ComponentLink2URL: http://datasheets.maximintegrated.com/en/ds/MAX5402.pdf; ComponentLink3Description: Package Specification; ComponentLink3URL: http://pdfserv.maximintegrated.com/package_dwgs/21-0036.PDF
U15 = LTC1754ES6-5: Manufacturer: Linear Technology; Frequency(kHz): 700; Ishutdown(uA): 0.01; Isupply(mA): 0.013; Max Iout(mA): 40; Vin Max(V): 5.5; Vin Min(V): 2.7; Voutput: 5V; PackageVersion: Aug-07; PackageReference: S6-6; PackageDescription: 6-Pin Plastic SOT-23, Body 1.625 x 2.9 mm, Pitch 0.95 mm; RoHS: FALSE; Mounting Technology: Surface Mount; PartNumber: LTC1754ES6-5; ComponentLink1Description: Manufacturer URL; ComponentLink1URL: http://www.linear.com/; ComponentLink2Description: Datasheet; ComponentLink2URL: http://cds.linear.com/docs/en/datasheet/175435f.pdf; ComponentLink3Description: Package Specification; ComponentLink3URL: http://cds.linear.com/docs/en/datasheet/175435f.pdf
U16-U18 = Optoisolator1: LTV-816S; Published: 24-Mar-1999; LatestRevisionDate: 04-Mar-2005; LatestRevisionNote: Sch pins 3 & 4 Swapped.; DatasheetVersion: Nov-2003; PackageReference: DIP-4; Publisher: Altium Limited

## Nets that join several sheets
+3.3: Rev_C_Mcu (25 pins), Rev_C_Power (5 pins)
+5V: Rev_C_Mcu (IC2.5 J1.1), Rev_C_Power (C33.2 D19.2)
+11V: Rev_C_Mcu (8 pins), Rev_C_Power (C34.1 C35.2 DA1.3 L4.2)
+12V: Rev_C_Mcu (9 pins), Rev_C_Power (D19.1 D20.C IC3.1 Q6.1)
GND: Rev_C_Mcu (49 pins), Rev_C_Power (15 pins)
IP+: Rev_C_Mcu (IC1.1 IC1.2), Rev_C_Power (5 pins)
NO2_(Charge-): Rev_C_Mcu (K1.24 K2.24 K3.24 K4.24), Rev_C_Power (9 pins)
V_bat_12V: Rev_C_Mcu (R7.2 X4.6), Rev_C_Power (F1.1)
DMCS: Rev_C_Mcu (U4.58), Rev_C_Power (R48.1)
DMDIN: Rev_C_Mcu (U4.57), Rev_C_Power (R47.1)
DMSCLK: Rev_C_Mcu (U4.55), Rev_C_Power (R46.1)
ON_DCDC: Rev_C_Mcu (U4.38), Rev_C_Power (Q7.1 R42.1)